# EAGLE design 007 (EAGLE 9.6.2)

## Sheet 1 of 2
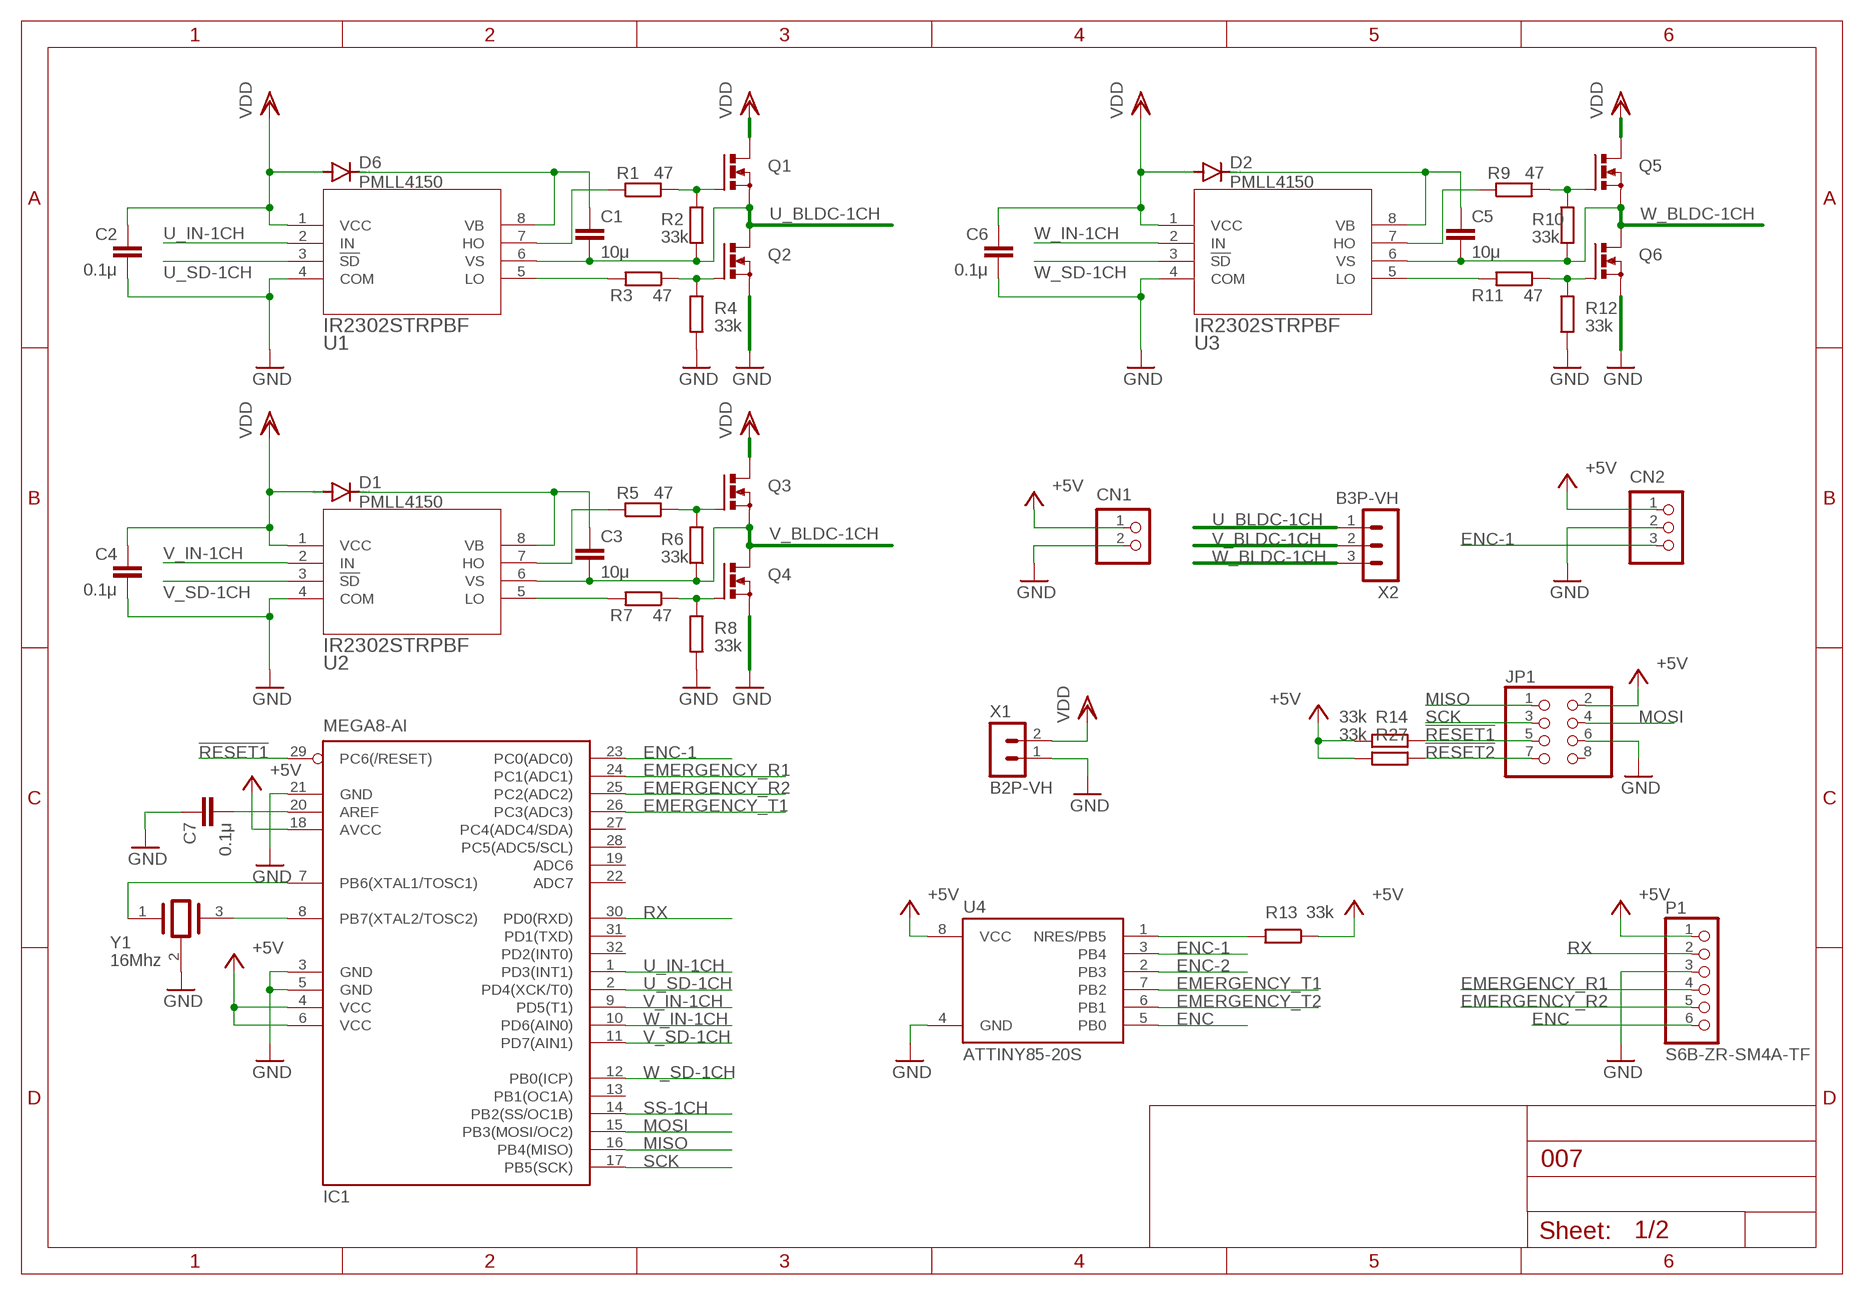
[diagram p0: schematic, sheet 1]

### Parts
C1  10μ  C-EUC1608  [C1608]
C2  0.1μ  C-EUC1608  [C1608]
C3  10μ  C-EUC1608  [C1608]
C4  0.1μ  C-EUC1608  [C1608]
C5  10μ  C-EUC1608  [C1608]
C6  0.1μ  C-EUC1608  [C1608]
C7  0.1μ  C-EUC1608  [C1608]
CN1  B2B-PH-K-S  [B2B-PH-K-S]
CN2  B3B-PH-K-S  [B3B-PH-K-S]
D1  PMLL4150  [SOD80C]
D2  PMLL4150  [SOD80C]
D6  PMLL4150  [SOD80C]
IC1  MEGA8-AI  [TQFP32-08]
JP1  PINHD-2X4  [2X04]
P1  S6B-ZR-SM4A-TF  [ZH-SM4-SIDE06]
Q1  N-MOSFET-SO8S  [SO-08]
Q2  N-MOSFET-SO8S  [SO-08]
Q3  N-MOSFET-SO8S  [SO-08]
Q4  N-MOSFET-SO8S  [SO-08]
Q5  N-MOSFET-SO8S  [SO-08]
Q6  N-MOSFET-SO8S  [SO-08]
R1  47  R-EU_R0603  [R0603]
R2  33k  R-EU_R0603  [R0603]
R3  47  R-EU_R0603  [R0603]
R4  33k  R-EU_R0603  [R0603]
R5  47  R-EU_R0603  [R0603]
R6  33k  R-EU_R0603  [R0603]
R7  47  R-EU_R0603  [R0603]
R8  33k  R-EU_R0603  [R0603]
R9  47  R-EU_R0603  [R0603]
R10  33k  R-EU_R0603  [R0603]
R11  47  R-EU_R0603  [R0603]
R12  33k  R-EU_R0603  [R0603]
R13  33k  R-EU_R0603  [R0603]
R14  33k  R-EU_R0603  [R0603]
R27  33k  R-EU_R0603  [R0603]
U1  IR2302STRPBF  [PG-DSO-8-910_INF]
U2  IR2302STRPBF  [PG-DSO-8-910_INF]
U3  IR2302STRPBF  [PG-DSO-8-910_INF]
U4  ATTINY85-20S  [SOIC8_EIAJ_208MIL]
X1  B2P-VH  [B2P-VH]
X2  B3P-VH  [B3P-VH]
Y1  16Mhz  MURATA_CSTNE16M0V53C000R0MURATA_CSTNE16M0V53C000R0_0_0  [MURATA_CSTNE16M0V53C000R0_0]

### Nets
!RESET1: IC1.29(PC6(/RESET)) JP1.5 R14.2
!RESET2: JP1.7 R27.2 ; also sheet 2
+5V: CN1.1 CN2.1 IC1.4(VCC) IC1.6(VCC) IC1.18(AVCC) JP1.2 P1.1 R13.1 R14.1 R27.1 U4.8(VCC) ; also sheet 2
EMERGENCY_R1: IC1.24(PC1(ADC1)) P1.4 ; also sheet 2
EMERGENCY_R2: IC1.25(PC2(ADC2)) P1.5 ; also sheet 2
EMERGENCY_T1: IC1.26(PC3(ADC3)) U4.7(PB2)
EMERGENCY_T2: U4.6(PB1) ; also sheet 2
ENC: P1.6 U4.5(PB0)
ENC-1: CN2.3 IC1.23(PC0(ADC0)) U4.3(PB4)
ENC-2: U4.2(PB3) ; also sheet 2
GND: C2.1 C4.1 C6.1 C7.2 CN1.2 CN2.2 IC1.3(GND) IC1.5(GND) IC1.21(GND) JP1.6 P1.3 Q2.1(S) Q2.2(S) Q2.3(S) Q4.1(S) Q4.2(S) Q4.3(S) Q6.1(S) Q6.2(S) Q6.3(S) R4.1 R8.1 R12.1 U1.4(COM) U2.4(COM) U3.4(COM) U4.4(GND) X1.1 Y1.2(GND) ; also sheet 2
MISO: IC1.16(PB4(MISO)) JP1.1 ; also sheet 2
MOSI: IC1.15(PB3(MOSI/OC2)) JP1.4 ; also sheet 2
N$1: C3.1 D1.C U2.8(VB)
N$2: C1.1 D6.C U1.8(VB)
N$3: R1.1 U1.7(HO)
N$4: R5.1 U2.7(HO)
N$5: Q1.4(G) R1.2 R2.2
N$6: Q2.4(G) R3.1 R4.2
N$7: R3.2 U1.5(LO)
N$8: Q3.4(G) R5.2 R6.2
N$9: Q4.4(G) R7.1 R8.2
N$10: R7.2 U2.5(LO)
N$11: C5.1 D2.C U3.8(VB)
N$12: R9.1 U3.7(HO)
N$13: Q5.4(G) R9.2 R10.2
N$14: Q6.4(G) R11.1 R12.2
N$15: R11.2 U3.5(LO)
N$16: R13.2 U4.1(NRES/PB5)
N$20: IC1.8(PB7(XTAL2/TOSC2)) Y1.3(OUTPUT)
N$21: IC1.7(PB6(XTAL1/TOSC1)) Y1.1(INPUT)
N$23: C7.1 IC1.20(AREF)
RX: IC1.30(PD0(RXD)) P1.2 ; also sheet 2
SCK: IC1.17(PB5(SCK)) JP1.3 ; also sheet 2
SS-1CH: IC1.14(PB2(SS/OC1B))
U_BLDC-1CH: C1.2 Q1.1(S) Q1.2(S) Q1.3(S) Q2.5(D) Q2.6(D) Q2.7(D) Q2.8(D) R2.1 U1.6(VS) X2.1
U_IN-1CH: IC1.1(PD3(INT1)) U1.2(IN)
U_SD-1CH: IC1.2(PD4(XCK/T0)) U1.3(!SD)
V_BLDC-1CH: C3.2 Q3.1(S) Q3.2(S) Q3.3(S) Q4.5(D) Q4.6(D) Q4.7(D) Q4.8(D) R6.1 U2.6(VS) X2.2
V_IN-1CH: IC1.9(PD5(T1)) U2.2(IN)
V_SD-1CH: IC1.11(PD7(AIN1)) U2.3(!SD)
VDD: C2.2 C4.2 C6.2 D1.A D2.A D6.A Q1.5(D) Q1.6(D) Q1.7(D) Q1.8(D) Q3.5(D) Q3.6(D) Q3.7(D) Q3.8(D) Q5.5(D) Q5.6(D) Q5.7(D) Q5.8(D) U1.1(VCC) U2.1(VCC) U3.1(VCC) X1.2 ; also sheet 2
W_BLDC-1CH: C5.2 Q5.1(S) Q5.2(S) Q5.3(S) Q6.5(D) Q6.6(D) Q6.7(D) Q6.8(D) R10.1 U3.6(VS) X2.3
W_IN-1CH: IC1.10(PD6(AIN0)) U3.2(IN)
W_SD-1CH: IC1.12(PB0(ICP)) U3.3(!SD)
Unconnected: IC1.13(PB1(OC1A)) IC1.19(ADC6) IC1.22(ADC7) IC1.27(PC4(ADC4/SDA)) IC1.28(PC5(ADC5/SCL)) IC1.31(PD1(TXD)) IC1.32(PD2(INT0)) JP1.8

## Sheet 2 of 2
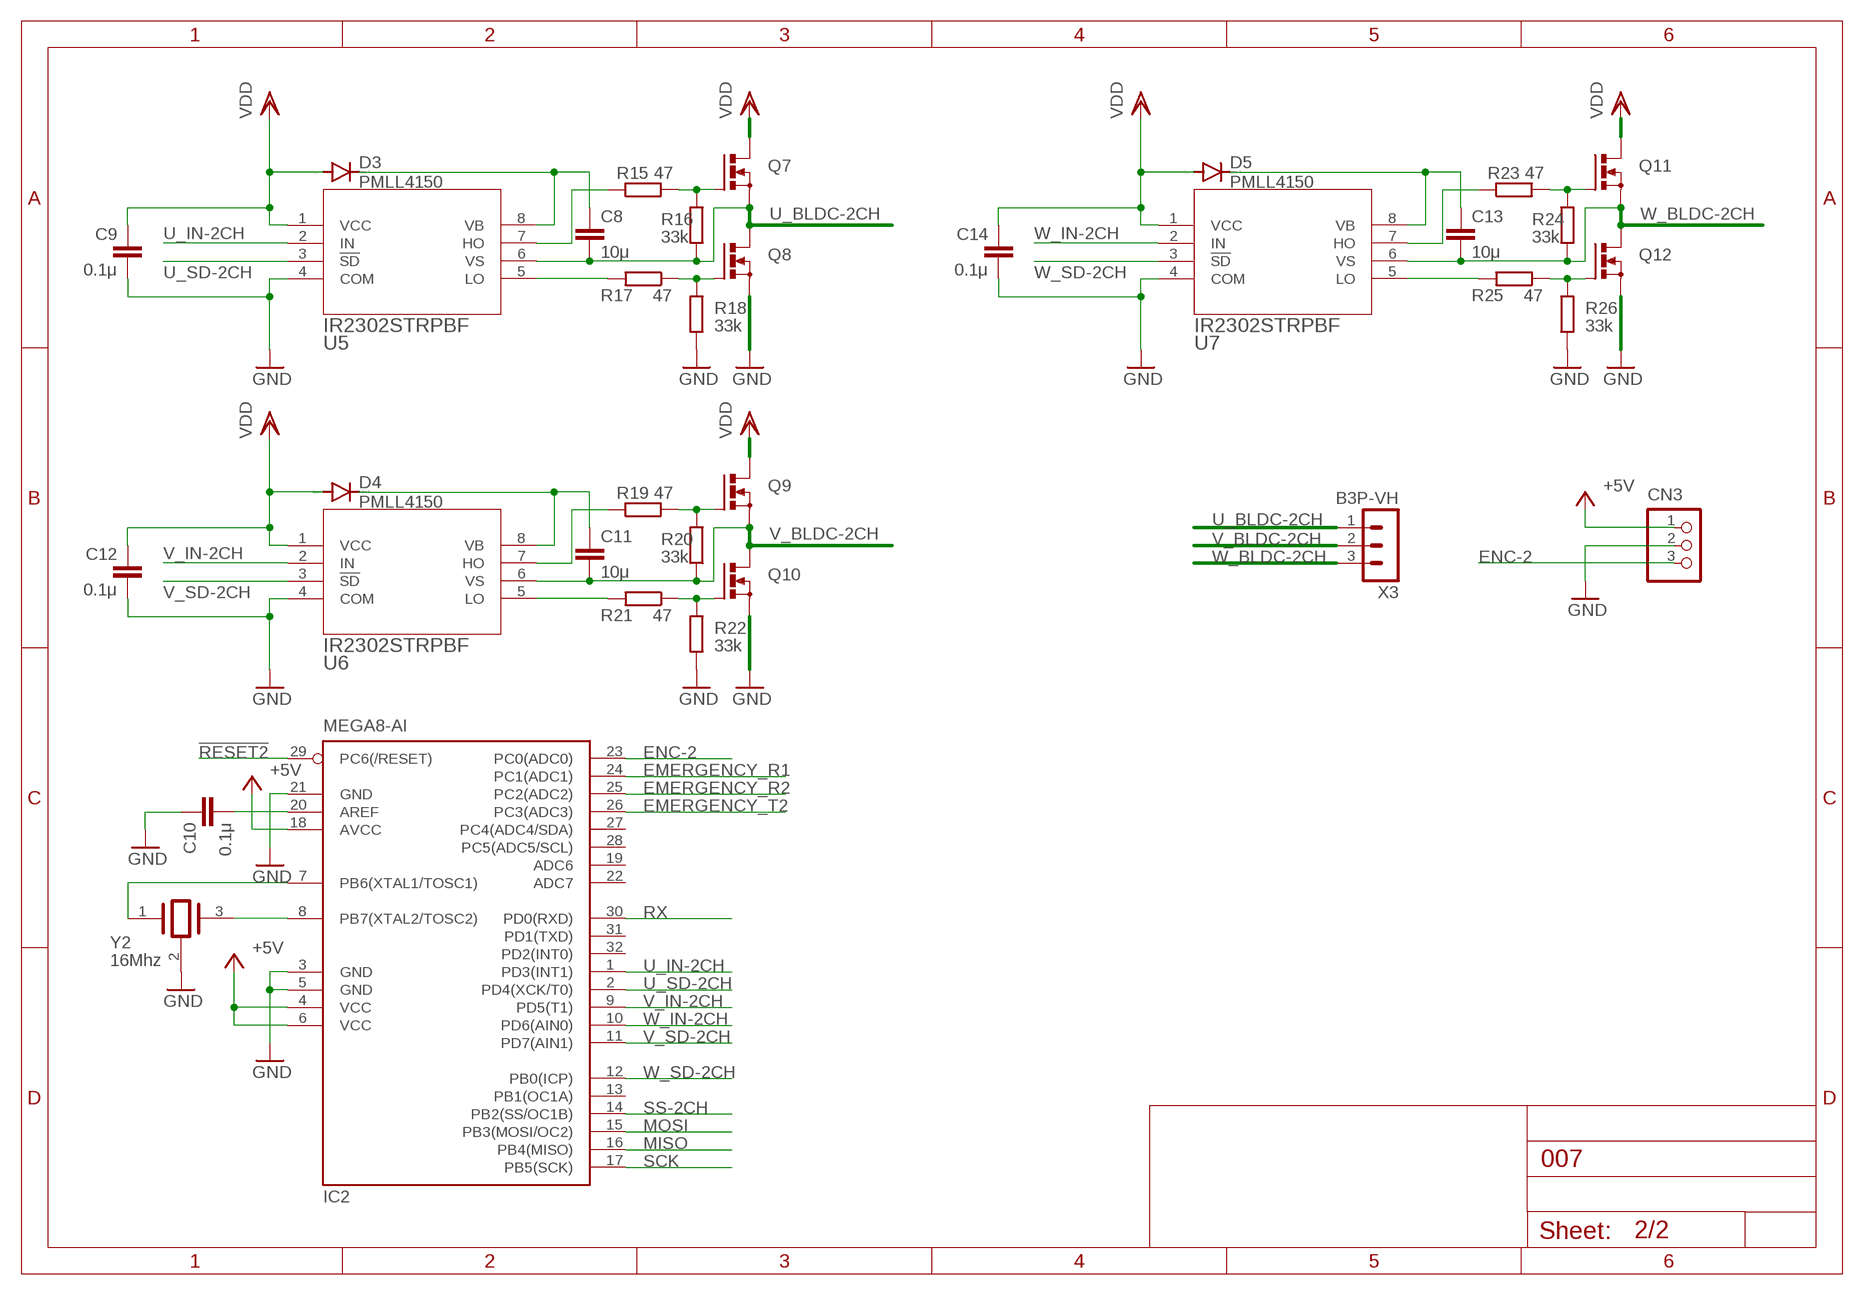
[diagram p1: schematic, sheet 2]

### Parts
C8  10μ  C-EUC1608  [C1608]
C9  0.1μ  C-EUC1608  [C1608]
C10  0.1μ  C-EUC1608  [C1608]
C11  10μ  C-EUC1608  [C1608]
C12  0.1μ  C-EUC1608  [C1608]
C13  10μ  C-EUC1608  [C1608]
C14  0.1μ  C-EUC1608  [C1608]
CN3  B3B-PH-K-S  [B3B-PH-K-S]
D3  PMLL4150  [SOD80C]
D4  PMLL4150  [SOD80C]
D5  PMLL4150  [SOD80C]
IC2  MEGA8-AI  [TQFP32-08]
Q7  N-MOSFET-SO8S  [SO-08]
Q8  N-MOSFET-SO8S  [SO-08]
Q9  N-MOSFET-SO8S  [SO-08]
Q10  N-MOSFET-SO8S  [SO-08]
Q11  N-MOSFET-SO8S  [SO-08]
Q12  N-MOSFET-SO8S  [SO-08]
R15  47  R-EU_R0603  [R0603]
R16  33k  R-EU_R0603  [R0603]
R17  47  R-EU_R0603  [R0603]
R18  33k  R-EU_R0603  [R0603]
R19  47  R-EU_R0603  [R0603]
R20  33k  R-EU_R0603  [R0603]
R21  47  R-EU_R0603  [R0603]
R22  33k  R-EU_R0603  [R0603]
R23  47  R-EU_R0603  [R0603]
R24  33k  R-EU_R0603  [R0603]
R25  47  R-EU_R0603  [R0603]
R26  33k  R-EU_R0603  [R0603]
U5  IR2302STRPBF  [PG-DSO-8-910_INF]
U6  IR2302STRPBF  [PG-DSO-8-910_INF]
U7  IR2302STRPBF  [PG-DSO-8-910_INF]
X3  B3P-VH  [B3P-VH]
Y2  16Mhz  MURATA_CSTNE16M0V53C000R0MURATA_CSTNE16M0V53C000R0_0_0  [MURATA_CSTNE16M0V53C000R0_0]

### Nets
!RESET2: IC2.29(PC6(/RESET)) ; also sheet 1
+5V: CN3.1 IC2.4(VCC) IC2.6(VCC) IC2.18(AVCC) ; also sheet 1
EMERGENCY_R1: IC2.24(PC1(ADC1)) ; also sheet 1
EMERGENCY_R2: IC2.25(PC2(ADC2)) ; also sheet 1
EMERGENCY_T2: IC2.26(PC3(ADC3)) ; also sheet 1
ENC-2: CN3.3 IC2.23(PC0(ADC0)) ; also sheet 1
GND: C9.1 C10.2 C12.1 C14.1 CN3.2 IC2.3(GND) IC2.5(GND) IC2.21(GND) Q8.1(S) Q8.2(S) Q8.3(S) Q10.1(S) Q10.2(S) Q10.3(S) Q12.1(S) Q12.2(S) Q12.3(S) R18.1 R22.1 R26.1 U5.4(COM) U6.4(COM) U7.4(COM) Y2.2(GND) ; also sheet 1
MISO: IC2.16(PB4(MISO)) ; also sheet 1
MOSI: IC2.15(PB3(MOSI/OC2)) ; also sheet 1
N$17: C8.1 D3.C U5.8(VB)
N$18: R15.1 U5.7(HO)
N$19: Q7.4(G) R15.2 R16.2
N$22: Q8.4(G) R17.1 R18.2
N$24: R17.2 U5.5(LO)
N$25: IC2.8(PB7(XTAL2/TOSC2)) Y2.3(OUTPUT)
N$26: IC2.7(PB6(XTAL1/TOSC1)) Y2.1(INPUT)
N$27: C10.1 IC2.20(AREF)
N$28: C11.1 D4.C U6.8(VB)
N$29: R19.1 U6.7(HO)
N$30: Q9.4(G) R19.2 R20.2
N$31: Q10.4(G) R21.1 R22.2
N$32: R21.2 U6.5(LO)
N$33: C13.1 D5.C U7.8(VB)
N$34: R23.1 U7.7(HO)
N$35: Q11.4(G) R23.2 R24.2
N$36: Q12.4(G) R25.1 R26.2
N$37: R25.2 U7.5(LO)
RX: IC2.30(PD0(RXD)) ; also sheet 1
SCK: IC2.17(PB5(SCK)) ; also sheet 1
SS-2CH: IC2.14(PB2(SS/OC1B))
U_BLDC-2CH: C8.2 Q7.1(S) Q7.2(S) Q7.3(S) Q8.5(D) Q8.6(D) Q8.7(D) Q8.8(D) R16.1 U5.6(VS) X3.1
U_IN-2CH: IC2.1(PD3(INT1)) U5.2(IN)
U_SD-2CH: IC2.2(PD4(XCK/T0)) U5.3(!SD)
V_BLDC-2CH: C11.2 Q9.1(S) Q9.2(S) Q9.3(S) Q10.5(D) Q10.6(D) Q10.7(D) Q10.8(D) R20.1 U6.6(VS) X3.2
V_IN-2CH: IC2.9(PD5(T1)) U6.2(IN)
V_SD-2CH: IC2.11(PD7(AIN1)) U6.3(!SD)
VDD: C9.2 C12.2 C14.2 D3.A D4.A D5.A Q7.5(D) Q7.6(D) Q7.7(D) Q7.8(D) Q9.5(D) Q9.6(D) Q9.7(D) Q9.8(D) Q11.5(D) Q11.6(D) Q11.7(D) Q11.8(D) U5.1(VCC) U6.1(VCC) U7.1(VCC) ; also sheet 1
W_BLDC-2CH: C13.2 Q11.1(S) Q11.2(S) Q11.3(S) Q12.5(D) Q12.6(D) Q12.7(D) Q12.8(D) R24.1 U7.6(VS) X3.3
W_IN-2CH: IC2.10(PD6(AIN0)) U7.2(IN)
W_SD-2CH: IC2.12(PB0(ICP)) U7.3(!SD)
Unconnected: IC2.13(PB1(OC1A)) IC2.19(ADC6) IC2.22(ADC7) IC2.27(PC4(ADC4/SDA)) IC2.28(PC5(ADC5/SCL)) IC2.31(PD1(TXD)) IC2.32(PD2(INT0))

## Library data of the parts
C1-C14 = rcl:C-EU: CAPACITOR, European symbol; SPICEPREFIX: C
CN1 = jst-ph:B2B-PH-*: Wire-to-Board 2.0mm pitch top mount connector Source: http://www.jst-mfg.com/product/pdf/jpn/PH.pdf http://www.jst-mfg.com/product/detail.php?series=199
CN2 CN3 = jst-ph:B3B-PH-*: Wire-to-Board 2.0mm pitch top mount connector Source: http://www.jst-mfg.com/product/pdf/jpn/PH.pdf http://www.jst-mfg.com/product/detail.php?series=199
D1-D6 = diode:PMLL4150: DIODE high speed
IC1 IC2 = atmel:MEGA8: MICROCONTROLLER 8 Kbytes FLASH, 1 kbytes SRAM, 512 bytes EEPROM, USART, 6-channel 10 bit ADC, 2-channel 8 bit ADC Pin compatible with Atmega48, ATMega88, ATMega168 Source: avr.lbr; MPN: ATMEGA8-16AU; OC_FARNELL: 9171371; OC_NEWARK: 73M8863
JP1 = pinhead:PINHD-2X4: PIN HEADER
P1 = zh:S6B-ZR-SM4A-TF
Q1-Q12 = transistor-power:N-MOSFET-SO8: N-Channel MOSFET Example: FDS7760A; N-Channel Logic Level PowerTrench® MOSFET FDS2572; N-Channel UltraFET® Trench MOSFET Source: www.fairchildsemi.com
R1-R27 = rcl:R-EU_: RESISTOR, European symbol; SPICEPREFIX: R
U1-U3 U5-U7 = IR2302:IR2302STRPBF; BUILT_BY: EMA_Cory; COPYRIGHT: Copyright (C) 2018 Accelerated Designs. All rights reserved; DATASHEET: https://www.infineon.com/dgdl/Infineon-IR2302-DataSheet-v01_00-EN.pdf?fileId=5546d462533600a4015355c988b216de; MANUFACTURER_PART_NUMBER: IR2302STRPBF; SOURCELIBRARY: Add_to_database_2021-04-22; VENDOR: Infineon
U4 = _hhn_attiny25_45_85:ATTINY85*: ATMEL ATtiny 85 Packages: P = PDIP 08 30mil S = SOIC 08 EIAJ 208mil Technologies Note: for complete ordering code (temp. range, finish, tape&reel etc.) see www.atmel.com • Supply Voltage: V = (1.8…5.5)V | [blank] = (2.7…5.5)V • Speed: 10 = 10 MHz | 20 = 20 MHz Author: Dipl.-Ing. FH Rainer Bayer HHN Hochschule Heilbronn (Heilbronn University), rainer.bayer@hs-heilbronn.de Ingenieurbüro ing-rb, mail@ing-rb.de
X1 = con-JST VH:B2P-VH: JST VH Series header 3.96mm pitch disconnectable crimp style connectors, vertical (side entry type), 2 pins
X2 X3 = con-JST VH:B3P-VH: JST VH Series header 3.96mm pitch disconnectable crimp style connectors, vertical (side entry type), 3 pins
Y1 Y2 = Murata - CSTNE16M0V53C000R0:MURATA_CSTNE16M0V53C000R0: 16MHz Ceramic Resonator Built in Capacitor 15pF ±0.15% 40 Ohms -40°C ~ 125°C Surface Mount; AUTOMOTIVE: Yes; AUTOMOTIVE_GRADE: Grade 1; CENTROID_NOT_SPECIFIED: No; DATASHEET: https://www.murata.com/ja-jp/products/productdetail.aspx?partno=CSTNE16M0V53C000R0; DEVICE_CLASS_L1: Passive Components; DEVICE_CLASS_L2: Crystals / Oscillators; DEVICE_CLASS_L3: Resonators; DIGIKEY_DESCRIPTION: CERAMIC RES 16.0000MHZ 15PF SMD; DIGIKEY_PART_NUMBER: 490-17949-1-ND; FOOTPRINT_VARIANT_NAME_0: Recommended_Land_Pattern; FREQUENCY: 16MHz; HEIGHT: 1mm; LEAD_FREE: Yes; LOAD_CAPACITANCE: 15pF; MF: Murata; MFG_PACKAGE_IDENT: 0; MFG_PACKAGE_IDENT_DATE: 0; MFG_PACKAGE_IDENT_REV: 0; MOUSER_DESCRIPTION: Ceramic Resonator 16MHz ±0.5% (Tol) ±0.15% (Stability) 15pF 40Ohm Automotive 3-Pin CSMD T/R; MOUSER_PART_NUMBER: 81-CSTNE16M0V53C000R; MPN: CSTNE16M0V53C000R0; PACKAGE: SMD; PREFIX: Y; ROHS: Yes; SERIES: CSTNE_V_C; STABILITY: 0.15%; TEMPERATURE_RANGE_HIGH: +125°C; TEMPERATURE_RANGE_LOW: -40°C; TOLERANCE: 0.5%; VERIFICATION_VERSION: 0.0.0.3

## Net classes
0 default: width 0.152 mm

## Board
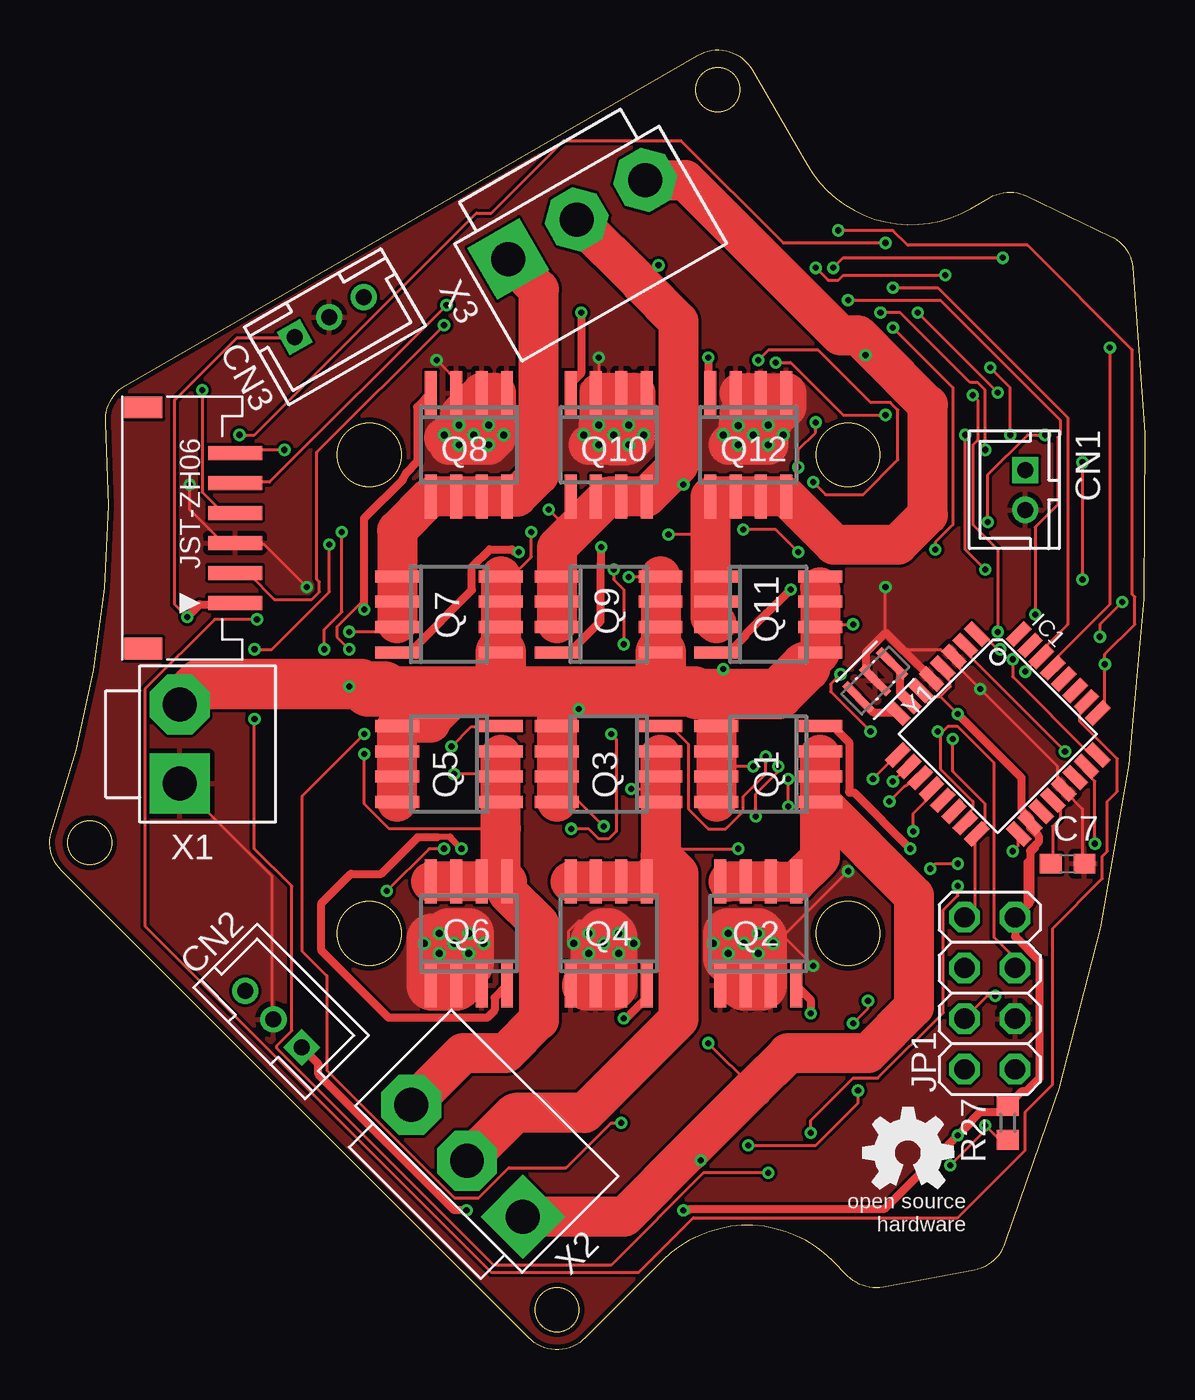
[diagram p2: board, top side]
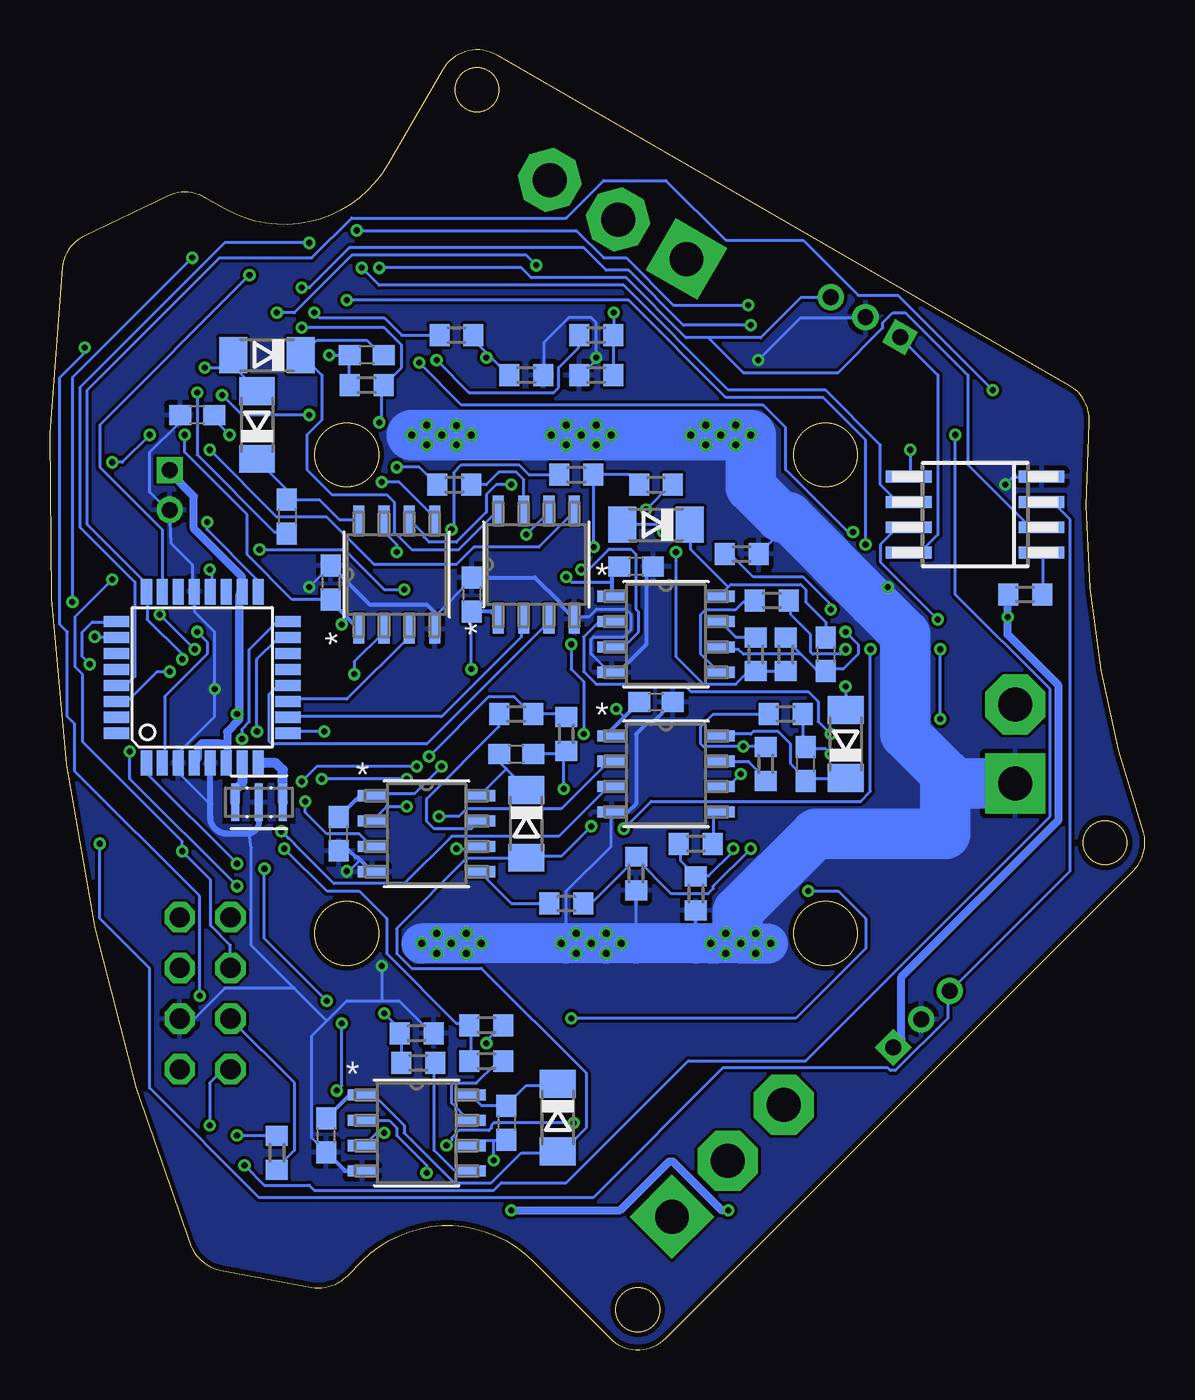
[diagram p3: board, bottom side, seen from below]

Size 54.89 x 65.17 mm. Coordinates in mm from the lower left corner, seen from the top.
Outline: 26.83,0.58 arc-90 24,0.58 0.58,24 arc-64 0.11,26.08 arc24 2.79,46.46 arc-64 3.79,48.34 32.47,64.9 arc-90 35.2,64.17 37.95,59.41 arc90 46.15,57.21 47.11,57.77 arc-56 48.98,57.84 53.15,55.84 arc-58 54.28,54.26 arc-28 47.82,5.22 arc-58 46.33,3.98 41.77,3.13 arc-56 39.99,3.69 39.21,4.47 arc90 30.72,4.47 26.83,0.58
Outline: circle at 40.01,20.87 radius 1.6
Outline: circle at 16.01,44.87 radius 1.6
Outline: circle at 16.01,20.87 radius 1.6
Outline: circle at 40.01,44.87 radius 1.6
Outline: circle at 2,25.42 radius 1.1
Outline: circle at 25.42,2 radius 1.1
Outline: circle at 33.47,63.17 radius 1.1
Copper layers (1*16): Top 0.035mm / dielectric 1.5mm / Bottom 0.035mm
Design rules "SeeedStudio_2layer_DRU_no_angle_20140221": minimum track width 6mil, minimum drill 12mil, track to track 6mil, track to pad 6mil, pad to pad 6mil, via to via 6mil, smd to smd 0mil, copper to edge 10mil, drill to drill 10mil, minimum pad ring 10mil, minimum via ring 6mil, stop-mask expansion 2mil, vias tented up to drill 100mil, thermal gap 10mil

### Footprints (pad centres in the part's own frame; a part is rotated, then mirrored left to right if it is on the bottom)
C1608 = smd 1.1 x 1: 1 -0.85,0; 2 0.85,0
B2B-PH-K-S = drill 0.8 square: 1 -1,0 | drill 0.8: 2 1,0
B3B-PH-K-S = drill 0.8 square: 1 -2,0 | drill 0.8: 2 0,0; 3 2,0
SOD80C = smd 1.4 x 1.8: A 1.7,0; C -1.7,0
TQFP32-08 = smd 1.27 x 0.559: 1 -4.293,2.8; 2 -4.293,2; 3 -4.293,1.2; 4 -4.293,0.4; 5 -4.293,-0.4; 6 -4.293,-1.2; 7 -4.293,-2; 8 -4.293,-2.8; 17 4.293,-2.8; 18 4.293,-2; 19 4.293,-1.2; 20 4.293,-0.4; 21 4.293,0.4; 22 4.293,1.2; 23 4.293,2; 24 4.293,2.8 | smd 0.559 x 1.27: 9 -2.8,-4.293; 10 -2,-4.293; 11 -1.2,-4.293; 12 -0.4,-4.293; 13 0.4,-4.293; 14 1.2,-4.293; 15 2,-4.293; 16 2.8,-4.293; 25 2.8,4.293; 26 2,4.293; 27 1.2,4.293; 28 0.4,4.293; 29 -0.4,4.293; 30 -1.2,4.293; 31 -2,4.293; 32 -2.8,4.293
2X04 = drill 1.016 octagon: 1 -3.81,-1.27; 2 -3.81,1.27; 3 -1.27,-1.27; 4 -1.27,1.27; 5 1.27,-1.27; 6 1.27,1.27; 7 3.81,-1.27; 8 3.81,1.27
ZH-SM4-SIDE06 = smd 0.7 x 2.7: 1 -10.35,-5.65; 2 -8.85,-5.65; 3 -7.35,-5.65; 4 -5.85,-5.65; 5 -4.35,-5.65; 6 -2.85,-5.65 | smd 1.1 x 1.9: P$1 -0.55,-1.05; P$2 -12.65,-1.05
SO-08 = smd 0.6 x 2.2: 1 -1.905,-2.6; 2 -0.635,-2.6; 3 0.635,-2.6; 4 1.905,-2.6; 5 1.905,2.6; 6 0.635,2.6; 7 -0.635,2.6; 8 -1.905,2.6
R0603 = smd 1 x 1.1: 1 -0.85,0; 2 0.85,0
PG-DSO-8-910_INF = smd 1.46 x 0.559: 1 -2.724,1.905; 2 -2.724,0.635; 3 -2.724,-0.635; 4 -2.724,-1.905; 5 2.724,-1.905; 6 2.724,-0.635; 7 2.724,0.635; 8 2.724,1.905
SOIC8_EIAJ_208MIL = smd 0.6 x 2.286: 1 -1.905,-3.33; 2 -0.635,-3.33; 3 0.635,-3.33; 4 1.905,-3.33; 5 1.905,3.33; 6 0.635,3.33; 7 -0.635,3.33; 8 -1.905,3.33
B2P-VH = drill 1.7 pad 3 square: 1 -1.98,0 | drill 1.7 pad 3 octagon: 2 1.98,0
B3P-VH = drill 1.7 pad 3 square: 1 -3.96,0 | drill 1.7 pad 3 octagon: 2 0,0; 3 3.96,0
MURATA_CSTNE16M0V53C000R0_0 = smd 0.4 x 1.9: 1 -1.2,0; 2 0,0; 3 1.2,0

### Placement (x,y rotation side)
C1  32.01,11.37 270 bottom
C2  40.41,25.87 90 bottom
C3  31.51,29.87 0 bottom
C4  24.51,32.47 180 bottom
C5  17.01,29.37 90 bottom
C6  41.03,10.75 90 bottom
C7  51.01,24.37 0 top
C8  16.01,34.87 270 bottom
C9  33.74,37.87 270 bottom
C10  47.51,46.87 180 bottom
C11  43.01,41.78 270 bottom
C12  40.81,38.47 270 bottom
C13  39.01,49.87 180 bottom
C14  25.51,39.27 180 bottom
CN1  48.89,43.11 270 top
CN2  11.21,16.57 135 top
CN3  14.01,51.77 30 top
D1  31.01,26.37 270 bottom
D2  15.01,30.37 90 bottom
D3  24.51,41.37 180 bottom
D4  44.51,46.37 90 bottom
D5  44.01,49.87 180 bottom
D6  29.43,11.64 270 bottom
IC1  47.51,30.87 315 top
IC2  47.25,33.71 90 bottom
JP1  47.11,17.87 270 top
P1  3.64,47.8 90 top
Q1  36.01,29.37 90 top
Q2  35.51,20.87 0 top
Q3  28.01,29.37 90 top
Q4  28.01,20.87 0 top
Q5  20.01,29.37 90 top
Q6  21.01,20.87 0 top
Q7  20.01,36.87 270 top
Q8  21.01,45.37 180 top
Q9  28.01,36.87 270 top
Q10  28.01,45.37 180 top
Q11  36.01,36.87 270 top
Q12  35.01,45.37 180 top
R1  33.01,14.47 180 bottom
R2  33.01,16.27 180 bottom
R3  36.43,14.38 0 bottom
R4  36.51,15.87 180 bottom
R5  31.51,31.87 0 bottom
R6  29.01,30.87 90 bottom
R7  29.01,22.37 180 bottom
R8  25.51,23.87 90 bottom
R9  19.01,29.37 90 bottom
R10  18.01,31.87 180 bottom
R11  22.51,25.37 0 bottom
R12  22.51,22.87 90 bottom
R13  6.01,37.87 0 bottom
R14  43.51,9.87 270 bottom
R15  19.51,34.87 270 bottom
R16  18.01,34.87 270 bottom
R17  18.71,37.57 180 bottom
R18  20.22,39.89 180 bottom
R19  28.51,43.87 0 bottom
R20  24.51,43.37 180 bottom
R21  27.51,50.87 180 bottom
R22  27.51,48.87 0 bottom
R23  34.62,43.37 180 bottom
R24  39.01,48.37 0 bottom
R25  34.51,50.87 180 bottom
R26  31.01,48.87 180 bottom
R27  48.01,11.37 270 top
U1  36.51,10.87 0 bottom
U2  36.01,25.87 0 bottom
U3  24.01,28.87 0 bottom
U4  8.51,41.87 90 bottom
U5  24.01,35.87 0 bottom
U6  37.51,38.87 90 bottom
U7  30.51,39.37 90 bottom
U$1  [OSHW_5MM]  43.01,9.87 0 top
X1  6.51,30.37 90 top
X2  20.91,9.47 135 top
X3  26.41,56.67 30 top
Y1  41.37,33.56 225 top
Y2  44.41,27.45 0 bottom

### Tracks (layer width: path | path; a pad name or v marks a point on that pad's centre or on a via)
!RESET1  (via drill 0.3)
  Top 0.152: v53.13,50.24 53.13,37.37 50.38,34.62 50.38,34.24 IC1.29 | JP1.5 46.98,17.74 v47.38,17.74
  Bottom 0.152: JP1.5 42.63,13.39 42.63,9.99 43.51,9.12 R14.2 | v53.13,50.24 53.13,49.99 54.38,48.74 54.38,36.37 54.01,35.99 54.01,31.74 53.63,31.37 53.63,28.99 47.38,22.74 v47.38,17.74
!RESET2  (via drill 0.3)
  Top 0.152: 47.01,11.12 47.51,10.62 48.01,10.62 R27.2 | v41.88,55.49 36.76,55.49 31.63,60.62 25.76,60.62 22.13,56.99 21.38,56.99 10.26,45.87 v9.51,45.87 | 47.01,11.12 v45.13,9.24 | 47.01,11.12 v46.88,11.24
  Bottom 0.152: v46.88,11.24 46.88,13.37 46.35,13.9 JP1.7 | v41.88,55.49 46.13,55.49 53.38,48.24 53.38,41.24 50.63,38.49 50.63,33.74 51.01,33.37 51.51,33.37 IC2.29 | v9.51,45.87 9.51,37.87 4.76,33.12 4.76,26.74 17.01,14.49 22.88,14.49 29.01,8.37 32.26,8.37 32.63,7.99 41.63,7.99 41.88,8.24 44.13,8.24 v45.13,9.24
+5V  (via drill 0.3)
  Top 0.152: 44.63,32.74 45.13,33.24 45.13,33.49 44.76,33.87 44.76,34.12 IC1.4 | 44.63,32.74 43.88,32.74 43.63,32.99 IC1.6 | 48.01,12.24 R27.1 | JP1.2 48.88,21.99 48.88,24.49 49.51,25.12 49.51,25.74 49.13,26.12 49.13,26.37 IC1.18 49.01,26.49 48.76,26.74 48.76,28.62 v45.51,31.87 44.63,32.74 | 9.26,37.37 P1.1 | v6.88,36.74 6.26,37.37 6.26,47.62 9.38,50.74 12.26,50.74 CN3.1 | 32.01,6.99 v31.76,6.99
  Top 0.4: 49.13,26.37 49.13,26.65 48.69,27.09 48.69,28.68 v45.51,31.87 | IC1.18 49.13,26.18 49.56,25.74 49.56,25.45 49.13,25.02 49.13,22.43 JP1.2 48.38,20.71 49.59,19.5 49.59,13.59 48.94,12.94 48.71,12.94 48.01,12.24 | R27.1 47.69,11.9 46.61,11.9 46.22,11.51 46.22,11.46 v45.51,10.74 41.81,7.04 32.08,7.04 32.02,6.99 32.01,6.99 | CN2.1 13.45,14.32 13.45,13.81 20.27,6.99 v20.88,6.99 | v6.88,36.74 7.51,37.37 9.26,37.37
  Bottom 0.152: 45.26,31.87 45.26,31.62 46.01,30.87 46.01,30.37 | 45.26,31.87 IC2.18 45.26,38.12 | 46.01,30.37 46.01,29.49 IC2.6 | 46.01,30.37 47.26,30.37 47.63,29.99 47.63,29.49 IC2.4 | 48.88,43.99 CN1.1 | v45.51,10.74 43.51,10.74 R14.1 | v45.51,31.87 45.26,31.87 | U4.8 11.76,39.99 11.26,39.99 10.38,40.87 10.38,48.87 12.26,50.74 CN3.1 | 6.88,37.87 R13.1
  Bottom 0.4: 48.88,43.99 47.66,42.77 47.66,41.17 45.25,38.75 IC2.18 45.41,37.83 45.41,31.56 46.01,30.97 46.01,29.49 | 46.01,30.37 46.39,30.37 46.42,30.4 47.27,30.4 47.48,30.19 47.48,29.64 47.63,29.49 | v31.76,6.99 26.3,6.99 23.85,9.44 23.66,9.44 21.21,6.99 v20.88,6.99 | CN2.1 12.21,15.56 12.21,18.68 4.33,26.56 4.33,33.29 6.88,35.85 v6.88,36.74 6.88,37.87
EMERGENCY_R1  (via drill 0.3)
  Top 0.152: v48.26,34.62 48.26,33.74 52.13,29.87 52.51,29.87 IC1.24 | v7.63,48.12 7.63,42.99 8.63,41.99 9.26,41.99 P1.4
  Bottom 0.152: v48.26,34.62 48.26,34.87 50.01,36.62 50.01,37.99 IC2.24 50.13,38.12 50.13,38.49 53.01,41.37 53.01,48.12 46.38,54.74 41.76,54.74 39.76,56.74 29.01,56.74 27.13,58.62 24.01,58.62 21.01,55.62 17.13,55.62 14.38,52.87 12.38,52.87 v7.63,48.12
EMERGENCY_R2  (via drill 0.3)
  Top 0.152: IC1.25 52.63,31.99 52.88,32.24 v52.88,34.37 52.88,34.87 54.38,36.37 54.38,37.74 54.26,37.87 54.26,50.12 49.01,55.37 43.01,55.37 42.26,56.12 v39.51,56.12 | v19.88,52.37 11.01,43.49 9.38,43.49 P1.5
  Bottom 0.152: v52.88,34.37 53.26,34.74 53.26,35.99 52.76,36.49 51.63,36.49 IC2.25 | v19.88,52.37 23.63,52.37 26.01,54.74 27.13,54.74 28.51,56.12 v39.51,56.12
EMERGENCY_T1  (via drill 0.3)
  Top 0.152: v10.38,36.62 8.26,36.62 4.76,33.12 4.76,21.24 22.13,3.87 29.51,3.87 32.26,6.62 45.51,6.62 48.88,9.99 48.88,11.92 50.26,13.29 50.26,21.12 52.76,23.62 52.76,24.74 53.01,24.99 53.01,27.49 53.51,27.99 53.51,29.62 51.63,31.49 51.63,31.87 51.88,32.12 51.88,32.37 IC1.26
  Bottom 0.152: v10.38,36.62 13.26,39.49 13.26,40.37 12.51,41.12 11.88,41.12 U4.7
EMERGENCY_T2  (via drill 0.3)
  Top 0.152: v52.63,35.74 52.63,36.37 v53.76,37.49 | v47.76,54.74 39.76,54.74 v39.26,54.24
  Bottom 0.152: v52.63,35.74 51.63,35.74 IC2.26 | v53.76,37.49 53.76,48.74 v47.76,54.74 | v39.26,54.24 38.38,53.37 26.13,53.37 20.88,48.12 16.01,48.12 13.26,45.37 13.26,43.37 12.51,42.62 11.88,42.62 U4.6
ENC  (via drill 0.3)
  Top 0.152: v11.76,45.12 9.51,45.12 9.38,44.99 P1.6
  Bottom 0.152: v11.76,45.12 11.76,43.87 U4.5
ENC-1  (via drill 0.3)
  Top 0.152: v52.38,25.37 52.38,28.49 52.01,28.87 52.01,29.24 IC1.23
  Bottom 0.152: v52.38,25.37 52.38,21.62 49.88,19.12 49.88,13.12 44.38,7.62 27.66,7.62 21.16,14.12 12.88,14.12 12.76,13.99 12.51,13.99 9.88,16.62 9.88,17.87 CN2.3 9.76,17.99 3.76,23.99 3.76,41.62 4.63,42.49 5.13,42.49 U4.3
ENC-2  (via drill 0.3)
  Top 0.152: v44.88,53.87 39.76,53.87 39.51,53.62 39.01,53.62 v38.38,54.24
  Bottom 0.152: v44.88,53.87 52.38,46.37 52.38,44.24 49.26,41.12 49.26,38.12 IC2.23 | v38.38,54.24 31.26,54.24 30.76,53.74 26.01,53.74 23.01,50.74 21.88,50.74 | 21.88,50.74 19.26,50.74 17.26,52.74 15.76,52.74 CN3.3 | 21.88,50.74 20.13,48.99 15.38,48.99 13.13,51.24 13.13,51.49 12.63,51.99 12.01,51.99 8.88,48.87 8.88,44.37 5.76,41.24 5.26,41.24 U4.2
GND  (via drill 0.3, 0.35)
  Top 0.152: 42.88,34.99 43.01,35.12 44.63,35.12 44.88,34.87 45.26,34.87 IC1.3 45.38,34.74 45.38,34.37 v46.63,33.12 50.51,29.24 50.51,28.37 50.76,28.12 IC1.21 50.88,27.99 51.76,27.12 51.76,24.37 C7.2 | v41.88,38.24 41.88,36.12 41.86,35.92 | v27.01,20.87 27.37,20.5 26.63,21.49 26.51,21.49 26.01,20.99 26.01,20.49 26.13,20.37 v26.26,20.37 | 28.51,19.99 27.37,19.99 | v40.01,23.99 36.88,20.87 35.69,20.68 | Q2.1 33.63,18.24 34.76,18.38 | v7.01,43.37 7.01,42.12 8.63,40.49 9.26,40.49 P1.3 9.38,40.37 10.76,40.37 v12.88,38.24 | Q6.1 19.13,18.24 19.76,18.87 | v27.51,49.74 27.51,48.87 Q10.3 | v19.38,49.62 20.63,48.37 Q8.3 | CN2.2 11.13,16.62 11.13,23.74 6.51,28.37 X1.1 | v38.26,19.24 36.88,20.62 35.69,20.62
  Top 0.2: v34.51,46.34 34.51,47.83 Q12.3 33.76,47.35 v33.76,45.87 | Q12.2 36.01,47.6 v36.01,46.37 | v35.26,45.87 35.01,45.87 | Q10.1 29.91,46.27 v29.01,45.37 v27.51,45.37 | Q10.1 29.35,47.41 29.35,46.21 | Q10.1 29.91,47.27 v29.01,46.37 | v27.51,46.37 27.51,46.83 Q10.2 | Q10.2 28.26,47.58 v28.26,45.87 | Q10.3 26.76,47.35 v26.76,45.87 | Q10.2 28.64,46.98 v29.76,45.87 | 35.01,47.97 35.01,46.74 v36.76,45.87 | v22.01,46.37 22.91,47.27 Q8.1 22.76,47.81 v22.76,45.87 | Q8.2 21.64,47.5 v20.51,46.37 | v21.26,45.87 21.26,47.08 Q8.3 | Q8.3 20.51,47.83 v20.51,45.37 | Q8.3 20.37,47 v22.01,45.37
  Top 0.305: v34.01,19.87 35.61,18.27 Q2.3 34.01,20.4 v34.01,20.87 | Q2.2 35.51,18.9 v35.51,20.87 | 34.78,18.27 v34.78,20.37 | Q2.2 34.87,19.23 v35.51,19.87 | Q2.2 34.87,18.98 v36.26,20.37 | v33.26,20.37 33.6,20.02 Q2.1 | 34.76,18.38 34.76,18.88 34.76,21.37 | Q4.3 28.64,19.73 v28.51,19.87 | Q4.1 26.26,18.42 v26.26,20.37 | v28.51,19.87 28.51,19.4 Q4.2 27.37,19.5 v27.01,19.87 27.51,20.37 v27.76,20.37 | v28.51,19.87 28.51,19.99 v28.51,20.87 | v29.26,20.37 28.51,20.37 28.01,20.87 | Q6.3 21.76,18.38 v21.76,20.37 | 19.63,19.49 v18.76,20.37 | v21.01,19.87 19.27,19.87 19.13,20 | v19.51,20.87 19.1,20.46 Q6.1 19.1,19.46 v19.51,19.87 | v20.26,20.37 20.26,18.38 Q6.2 20.86,18.27 19.63,19.49 | v21.01,20.87 19.63,19.49
  Top 0.406: Y1.2 40.91,34.02 40.91,34.97 41.86,35.92 41.96,35.92 42.88,34.99 44.19,33.68 IC1.5
  Top 2: 34.55,47.97 35.01,47.97 Q12.1 36.91,47.27 v36.01,46.37 v36.01,45.37 v34.51,45.37 v34.51,46.34 34.55,46.39 | Q12.2 34.55,46.88 34.55,46.39 | Q10.2 28.14,47.47 28.14,45.5 | Q10.2 27.55,47.97 27.55,46.39 27.51,46.34 v27.51,45.37 | 28.14,45.5 28.01,45.37 | 28.01,45.37 v27.51,45.37 | Q10.2 29.35,47.97 29.35,46.71 | 28.01,45.37 v29.01,45.37 29.01,45.42 29.32,45.73 | 28.14,45.5 29.35,46.71 | 29.35,46.21 29.35,46.71 | 34.55,46.39 34.55,45.91 34.01,45.37 | v27.51,45.37 27.01,45.37 | 19.76,45.71 19.88,45.71 20.55,46.39 20.55,46.88 Q8.2 22.35,47.97 22.35,45.71 v22.01,45.37 20.01,45.37
  Top 2.54: Q2.2 34.78,18.27 | Q2.2 35.69,18.27 35.69,20.62 35.69,20.68 v35.51,20.87 v34.01,20.87 34.01,19.63 34.76,18.88 | Q4.2 28.19,18.27 28.19,20.68 28.01,20.87 27.74,20.87 27.37,20.5 27.37,19.99 Q4.2 | Q4.2 26.93,18.27 | Q2.2 34.76,18.38 | 19.13,19.5 19.76,18.87 Q6.2 19.13,18.27 19.13,20 | 19.13,20 19.13,20.6 | 19.13,20 20,20.87 v21.01,20.87 21.01,19.37
  Bottom 0.152: C9.1 33.76,38.62 35.51,36.87 U6.4 | U7.4 28.51,36.74 27.88,36.74 27.51,37.12 26.01,37.12 25.76,36.87 25.76,36.12 26.13,35.74 27.63,35.74 27.76,35.62 27.76,34.87 26.76,33.87 U5.4 | v41.88,38.24 C12.1 | C10.2 48.38,46.87 48.38,46.49 49.88,44.99 49.88,42.99 49.01,42.12 CN1.2 48.81,40.42 47.76,39.37 47.76,38.12 IC2.21 47.63,37.99 47.63,36.99 46.63,35.99 v46.63,33.12 46.63,31.74 48.38,29.99 48.38,29.49 IC2.3 48.38,29.37 48.38,28.87 46.88,27.37 46.85,27.37 | 38.26,17.49 40.01,17.49 41.01,16.49 | 38.26,17.49 37.38,17.49 35.76,15.87 R4.1 | 41.01,16.49 41.76,15.74 41.76,10.62 41.13,9.99 C6.1 | 41.01,16.49 42.63,18.12 | 42.63,18.12 44.78,20.27 44.78,25.16 44.9,25.87 | 42.63,18.12 46.13,18.12 47.63,16.62 48.36,16.62 JP1.6 | v27.01,19.87 27.01,20.37 | 25.51,20.37 R8.1 | 22.51,20.74 R12.1 | 39.32,24.55 39.88,23.99 v40.01,23.99 | 29.01,20.37 29.01,22.99 26.76,25.24 26.76,26.87 U3.4 | v7.01,43.37 6.63,43.74 5.26,43.74 U4.4 | R18.1 19.26,39.99 18.63,40.62 18.24,41.74 | R26.1 30.13,48.87 30.13,50.49 28.88,51.74 27.76,51.74 27.51,51.49 v27.51,49.74 27.51,49.62 28.26,48.87 R22.1 | v19.38,49.62 17.26,51.74 14.01,51.74 CN3.2 | v20.26,20.37 20.41,21.17 | v12.88,38.24 13.63,37.49 | 22.51,20.74 22.51,20.37 | 22.51,20.74 v21.76,20.37 | v38.26,19.24 38.26,17.49
  Bottom 0.2: v36.01,45.37 35.76,45.37 v35.26,45.87 35.76,46.37 v36.01,46.37 36.63,45.74 v36.76,45.87 35.72,45.12 v34.51,46.34 34.23,46.34 v33.76,45.87 34.26,45.37 v34.51,45.37 | v29.76,45.87 29.51,45.87 v29.01,46.37 28.76,46.37 v28.26,45.87 | v28.26,45.87 28.51,45.87 v29.01,45.37 | v27.51,45.37 27.01,45.87 | 27.01,45.87 v27.51,46.37 27.76,46.37 v28.26,45.87 | 27.01,45.87 v26.76,45.87 | v20.51,45.37 19.3,45.37 v19.76,45.87 19.26,46.37 v20.51,46.37 21.01,45.87 v21.26,45.87 21.38,45.99 | v22.01,46.37 21.76,46.37 21.38,45.99 | 21.38,45.99 v22.01,45.37 22.51,45.87 v22.76,45.87 | C6.1 40.09,8.96 U1.4 | U2.4 39.32,24.55 39.47,24.7 39.56,24.7 39.88,25.02 C2.1 | C4.1 24.76,31.37 25.01,31.37 25.51,30.87 25.51,27.37 25.91,26.96 U3.4 | C14.1 25.01,38.92 25.01,35.37 26.41,33.96 U5.4 | U7.4 29.34,37.38 29.34,37.48 30.58,38.72 C9.1 | C12.1 38.86,37.37 36.01,37.37 35.6,36.96 U6.4
  Bottom 0.305: Y2.2 44.41,26.47 arc80 44.9,25.87 arc10 45.01,25.87 46.01,25.87 arc90 46.85,26.71 46.85,27.37 IC2.5
  Bottom 2: v20.26,20.37 20.51,20.62 | v20.26,20.37 v21.76,20.37 | 21.51,20.37 v21.76,20.37 | v21.76,20.37 22.51,20.37 25.51,20.37 27.01,20.37 29.01,20.37 v36.26,20.37 | v20.26,20.37 18.89,20.37
  Bottom 2.54: v36.76,45.87 27.01,45.87 | v26.76,45.87 v19.76,45.87 19.76,43.25 18.24,41.74 17.88,41.74 13.63,37.49 12.01,35.87 12.01,30.87 10.01,28.87 | 10.01,28.87 9.53,28.39 X1.1 | 10.01,28.87 10.01,25.87 16.51,25.87 20.41,21.97 20.41,21.17
  pour Top: 56.01,65.87 56.01,-1.13 -0.99,-1.13 -0.99,65.87
  pour Bottom: 56.01,65.87 56.01,-1.13 -0.99,-1.13 -0.99,65.87
MISO  (via drill 0.3)
  Top 0.152: JP1.1 46.35,21.83 46.38,21.87 46.38,25.74 IC1.16 46.51,25.87 46.88,26.24 46.88,27.37 45.26,28.99 v45.26,30.62
  Bottom 0.152: v45.26,30.62 45.26,31.12 44.88,31.49 44.88,35.12 43.51,36.49 43.01,36.49 IC2.16
MOSI  (via drill 0.3)
  Top 0.152: 44.63,30.87 44.63,29.12 46.26,27.49 46.26,27.12 46.01,26.87 46.01,26.49 IC1.15 | 44.63,30.87 45.01,31.24 45.51,31.24 47.33,29.42 47.33,20.67 48.38,19.62 JP1.4 | 44.63,30.87 v44.51,30.99
  Bottom 0.152: v44.51,30.99 44.51,34.62 43.51,35.62 43.01,35.62 IC2.15
N$1
  Bottom 0.152: 32.01,29.12 31.01,28.12 D1.C | 32.01,29.12 32.26,29.37 32.26,29.87 C3.1 | 32.01,29.12 33.26,27.87 U2.8
N$2
  Bottom 0.152: 32.01,12.24 33.26,12.24 33.76,12.74 U1.8 | 32.01,12.24 31.01,13.24 29.51,13.24 D6.C | 32.01,12.24 C1.1
N$3
  Bottom 0.152: R1.1 32.26,14.37 32.51,14.37 33.51,13.37 34.63,13.37 34.76,13.24 34.76,12.37 33.88,11.49 U1.7
N$4
  Bottom 0.152: R5.1 32.38,31.87 32.38,31.24 36.01,27.62 36.01,26.49 35.63,26.12 33.76,26.12 33.38,26.49 U2.7
N$5  (via drill 0.3)
  Top 0.152: 40.06,27.94 40.07,27.93
  Top 0.4: Q1.4 38.71,31.17 39.33,31.17 40.06,30.45 40.06,27.94 | 40.07,27.93 40.32,27.93 v43.13,25.12
  Bottom 0.152: R1.2 33.76,14.49 33.76,16.24 R2.2 33.88,16.37 34.51,16.37 38.01,19.87 38.01,21.62 39.38,22.99 41.01,22.99 v43.13,25.12
N$6  (via drill 0.3)
  Top 0.4: Q2.4 38.13,17.55 v38.13,16.87
  Bottom 0.152: R3.1 37.26,14.49 37.26,15.87 R4.2 37.38,15.87 37.38,16.12 v38.13,16.87
N$7
  Bottom 0.152: R3.2 35.63,14.37 35.63,9.99 34.63,8.99 33.88,8.99 U1.5
N$8  (via drill 0.3)
  Top 0.152: v35.88,29.74 35.88,28.87 34.76,27.74 34.76,26.99 33.88,26.12 33.01,26.12 32.01,27.12 32.01,30.37 31.13,31.24 30.63,31.24 Q3.4
  Bottom 0.152: R6.2 29.01,31.74 29.13,31.87 R5.2 30.76,31.87 31.63,32.74 32.88,32.74 v35.88,29.74
N$9  (via drill 0.3)
  Top 0.152: 29.88,17.74 29.88,18.24 Q4.4 | v16.88,22.99 19.01,25.12 v19.76,25.12
  Top 0.4: v28.76,16.62 28.78,16.64 28.92,16.64 29.88,17.61 29.88,17.74
  Bottom 0.152: R7.1 27.76,22.37 25.51,24.62 | v28.76,16.62 17.51,16.62 14.01,20.12 14.01,21.62 15.38,22.99 v16.88,22.99 | v19.76,25.12 21.63,23.24 21.63,23.12 21.88,22.87 23.76,22.87 25.51,24.62 | 25.51,24.62 R8.2
N$10
  Bottom 0.152: R7.2 31.76,22.37 33.26,23.87 U2.5
N$11
  Bottom 0.152: 17.01,28.62 15.01,28.62 D2.C | 17.01,28.62 17.76,29.37 17.76,30.37 18.38,30.99 19.63,30.99 19.76,30.87 21.26,30.87 U3.8 | 17.01,28.62 C5.1
N$12
  Bottom 0.152: R9.1 19.01,28.62 19.88,29.49 21.26,29.49 U3.7
N$13  (via drill 0.3)
  Top 0.152: v20.13,30.24 21.13,31.24 22.51,31.24 Q5.4
  Bottom 0.152: R10.2 21.63,31.87 22.26,31.24 22.26,30.37 22.13,30.24 v20.13,30.24 19.01,30.24 R9.2
N$14  (via drill 0.3)
  Top 0.152: 20.01,25.74 19.01,25.74
  Top 0.254: v20.63,25.12 20.58,25.12 20,25.7 19.05,25.7 19.01,25.74
  Top 0.305: 19.4,25.69 19.46,25.69 19.5,25.73 20.01,25.73 20.08,25.73 20.11,25.69 20.11,25.63 v20.63,25.12
  Top 0.4: Q6.4 22.29,17.65 22.29,17.02 21.92,16.64 16.98,16.64 13.61,20.02 13.61,22.38 15.09,23.86 16.6,23.86 18.43,25.69 19.4,25.69
  Bottom 0.152: 22.51,23.74 23.26,24.49 23.26,25.37 R11.1 | 22.51,23.74 21.88,23.74 20.63,24.99 v20.63,25.12 | 22.51,23.74 R12.2
N$15
  Bottom 0.152: R11.2 21.63,25.37 21.63,26.62 21.38,26.87 U3.5
N$16
  Bottom 0.152: R13.2 5.13,37.87 5.13,39.87 U4.1
N$17
  Bottom 0.152: C8.1 16.01,36.49 17.01,37.49 17.01,38.12 17.26,38.37 20.76,38.37 20.88,38.24 | 20.88,38.24 21.26,37.87 U5.8 | 20.88,38.24 22.76,40.12 22.76,41.37 D3.C
N$18
  Bottom 0.152: R15.1 19.51,35.74 20.51,35.74 21.26,36.49 U5.7
N$19  (via drill 0.3)
  Top 0.4: Q7.4 17.51,35.06 18.13,35.06 21.15,38.08 21.15,39.23 22.05,40.12 23.17,40.12 23.3,39.99 v23.51,39.99
  Bottom 0.152: 19.51,33.99 18.01,33.99 R16.2 | 19.51,33.99 19.88,33.99 20.51,33.37 22.13,33.37 23.51,34.74 v23.51,39.99 | 19.51,33.99 R15.2
N$20
  Top 0.406: IC1.8 41.3,31.92 Y1.3
N$21
  Top 0.406: IC1.7 42.61,32.93 42.61,34 Y1.1
N$22  (via drill 0.3)
  Top 0.152: 15.76,37.62 15.76,41.87 18.38,44.49 | 15.76,37.62 v15.76,37.12 | v15.01,35.12 14.38,35.74 14.38,36.24 15.76,37.62
  Top 0.4: v15.76,37.12 15.76,41.69 17.7,43.64 17.7,43.68 17.87,43.98 18.38,44.49 18.4,44.51 18.4,47.26 Q8.4
  Bottom 0.152: v15.76,37.12 15.76,37.37 17.13,38.74 19.63,38.74 20.76,39.87 21.01,39.87 R18.2 | v15.01,35.12 15.26,34.87 16.63,34.87 16.76,34.99 16.76,35.87 17.76,36.87 17.76,37.49 R17.1
N$23
  Top 0.152: C7.1 50.26,24.37 50.26,26.24 50.63,26.62 50.63,27.24 50.38,27.49 IC1.20
N$24
  Bottom 0.152: R17.2 19.63,37.49 20.13,37.49 20.51,37.12 22.01,37.12 22.26,36.87 22.26,34.87 21.38,33.99 U5.5
N$25
  Bottom 0.508: Y2.3 43.21,29.07 43.55,29.41 IC2.8
N$26
  Bottom 0.508: 45.25,29 IC2.7 45.25,28.41 45.61,28.05 Y2.1
N$27  (via drill 0.3)
  Top 0.152: v45.88,45.87 45.88,40.12 v46.88,39.12
  Bottom 0.152: v45.88,45.87 46.63,46.62 46.63,46.87 C10.1 | v46.88,39.12 46.76,38.99 46.76,38.12 IC2.20
N$28
  Bottom 0.152: D4.C 44.51,44.62 43.01,43.12 C11.1 41.38,42.62 40.38,41.62 39.51,41.62 U6.8
N$29  (via drill 0.3)
  Top 0.152: v34.76,41.12 36.38,41.12 v37.51,39.99
  Bottom 0.152: R19.1 30.88,43.87 31.38,44.37 34.26,44.37 34.63,43.99 34.63,41.24 v34.76,41.12 | v37.51,39.99 37.51,40.37 38.13,40.99 38.13,41.49 U6.7
N$30  (via drill 0.3)
  Top 0.4: Q9.4 25.51,35.06 26.13,35.06 27.6,36.52 27.6,39.39 27.63,39.42 v27.63,40.24
  Bottom 0.152: 27.63,43.87 25.88,43.87 25.38,43.37 R20.2 | v27.63,40.24 27.63,43.87 | 27.63,43.87 R19.2
N$31  (via drill 0.3)
  Top 0.4: Q10.4 26.2,48.07 26.2,48.53 26.63,48.96 v26.63,51.99
  Bottom 0.152: 26.63,50.87 26.63,48.87 R22.2 | v26.63,51.99 26.63,50.87 | 26.63,50.87 R21.1
N$32  (via drill 0.3)
  Top 0.152: v35.51,49.62 36.01,50.12 38.51,50.12 41.13,47.49 42.13,47.49 42.51,47.12 42.51,44.62 40.76,42.87 38.88,42.87 v38.26,43.49
  Bottom 0.152: v35.51,49.62 33.88,47.99 29.63,47.99 29.38,48.24 29.38,49.24 28.38,50.24 28.38,50.87 R21.2 | v38.26,43.49 37.38,43.49 35.51,41.62 U6.5
N$33
  Bottom 0.152: 42.26,49.87 41.51,50.62 39.01,50.62 38.26,49.87 C13.1 | 42.26,49.87 41.26,48.87 41.26,46.62 42.01,45.87 42.01,44.12 40.76,42.87 38.01,42.87 37.63,42.49 37.63,40.99 36.76,40.12 34.38,40.12 32.51,41.99 U7.8 | 42.26,49.87 D5.C
N$34
  Bottom 0.152: R23.1 33.01,43.37 32.38,43.99 31.51,43.99 31.13,43.62 31.13,42.12 U7.7
N$35  (via drill 0.3)
  Top 0.152: v38.38,46.49 38.38,45.99 37.51,45.12 v37.51,44.24 | v44.38,40.12 44.38,40.49 45.26,41.37 45.26,48.24 v42.26,51.24
  Top 0.4: Q11.4 33.51,35.06 34.13,35.06 34.86,35.78 34.86,35.84 v37.13,38.12
  Bottom 0.152: v38.38,46.49 38.26,46.62 38.26,48.37 R24.2 38.13,48.37 37.26,49.24 37.26,50.37 38.13,51.24 v42.26,51.24 | v37.51,44.24 36.38,44.24 35.51,43.37 R23.2 | v37.13,38.12 38.13,38.12 40.13,40.12 v44.38,40.12
N$36  (via drill 0.3)
  Top 0.152: 33.01,48.87 33.01,47.99 Q12.4
  Top 0.4: v33.01,49.74 33.01,48.87
  Bottom 0.152: 32.88,49.87 31.88,48.87 R26.2 | 32.88,49.87 33.63,50.62 33.63,50.87 R25.1 | 32.88,49.87 v33.01,49.74
N$37  (via drill 0.3)
  Top 0.152: v41.63,51.99 42.63,51.99 46.13,48.49 46.51,48.49 46.88,48.12 v46.88,45.12
  Bottom 0.152: R25.2 37.26,50.87 38.13,51.74 41.38,51.74 v41.63,51.99 | v46.88,45.12 43.51,41.74 41.01,41.74 38.63,39.37 34.51,39.37 33.63,40.24 30.38,40.24 28.63,41.99 U7.5
RX  (via drill 0.3)
  Top 0.152: v48.88,33.99 49.63,34.74 IC1.30 49.76,34.87 49.76,35.12 51.01,36.37 51.01,46.74 44.51,53.24 v42.26,53.24 | v19.76,51.37 13.38,44.99 13.38,38.62 13.51,38.49 13.51,37.99 13.13,37.62 11.26,37.62 10.01,38.87 9.38,38.87 P1.2
  Bottom 0.152: v48.88,33.99 49.51,33.99 50.88,32.62 51.51,32.62 IC2.30 | v42.26,53.24 41.88,53.24 39.88,55.24 28.13,55.24 27.01,54.12 25.88,54.12 23.13,51.37 v19.76,51.37
SCK  (via drill 0.3)
  Top 0.152: v48.26,24.99 48.51,25.24 48.51,25.74 48.56,25.8 IC1.17 | v51.76,44.49 v51.76,38.62 | v49.88,45.87 49.01,45.87 47.01,43.87 v47.01,41.49
  Bottom 0.152: v51.76,38.62 53.63,36.74 53.63,34.24 53.26,33.87 53.26,30.49 48.26,25.49 v48.26,24.99 46.83,23.56 46.83,21.27 45.84,20.27 JP1.3 | v51.76,44.49 51.26,44.49 v49.88,45.87 | v47.01,41.49 47.01,41.12 44.51,38.62 44.51,38.12 IC2.17
U_BLDC-1CH  (via drill 0.3)
  Top 0.152: 35.26,13.12 v33.01,15.37 | v32.63,9.49 32.13,9.99 | Q1.3 38.63,29.99 38.61,29.82
  Top 0.406: Q2.8 34.01,23.47 Q2.7 36.51,23.47 | Q2.6 37.01,23.47 | Q1.3 38.61,29.87 | 38.61,28.87 Q1.2 Q1.1
  Top 2: 38.61,28.87 38.61,24.66 Q2.5 37.01,23.47 36.51,23.47 34.01,23.47 | Q1.1 43.31,22.76 43.31,17.17 41.01,14.87 37.01,14.87 35.26,13.12 32.13,9.99 28.81,6.67 X2.1 | Q1.2 38.61,29.82
  Bottom 0.152: 32.63,10.49 33.51,10.49 33.76,10.24 U1.6 | 32.63,10.49 32.01,10.49 C1.2 | v33.01,15.37 33.01,15.49 32.26,16.24 R2.1 | v32.63,9.49 32.63,10.49
U_BLDC-2CH  (via drill 0.3)
  Top 0.152: Q8.7 21.63,42.74 21.63,42.77 | 17.41,38.74 17.38,38.74 Q7.1 | Q8.6 20.38,42.74 20.38,42.77 | Q7.2 17.38,37.49 Q7.2 | 17.41,36.41 17.38,36.12 Q7.3 16.51,35.99 v15.01,35.99
  Top 2: 17.41,36.41 Q7.2 17.41,38.74 Q7.1 17.41,41.07 Q8.5 Q8.6 20.38,42.77 21.63,42.77 Q8.7 Q8.8 23.41,42.77 24.51,43.87 24.51,53.16 X3.1
  Bottom 0.152: 17.26,34.87 16.51,34.12 16.01,34.12 | 17.26,34.87 18.01,35.62 R16.1 | 17.26,34.87 20.13,34.87 20.38,35.12 21.26,35.12 U5.6 | 16.01,34.12 15.13,34.12 14.38,34.87 14.38,35.37 v15.01,35.99 | 16.01,34.12 C8.2
U_IN-1CH  (via drill 0.3)
  Top 0.152: v47.63,35.12 47.51,35.12 46.76,35.87 46.51,35.87 IC1.1 | v49.38,36.87 49.38,41.24 50.51,42.37 50.51,45.74 50.63,45.87 50.63,46.62 44.63,52.62 v40.01,52.62 | v14.01,40.37 14.01,37.99 11.13,35.12 v10.26,35.12 | v10.26,31.62 10.26,25.12 12.13,23.24 12.13,15.99 11.38,15.24 11.38,15.12 22.26,4.24 28.13,4.24 32.76,8.87 v36.01,8.87
  Bottom 0.152: v49.38,36.87 v47.63,35.12 | v40.01,52.62 25.88,52.62 21.01,47.74 16.13,47.74 14.01,45.62 v14.01,40.37 | v10.26,31.62 v10.26,35.12 | v36.01,8.87 36.01,9.24 37.51,10.74 37.51,11.12 37.88,11.49 39.13,11.49 U1.2
U_IN-2CH  (via drill 0.3)
  Top 0.152: v45.51,24.37 44.38,24.37 v44.13,24.12 | v41.01,17.49 41.01,17.12 v40.26,16.37 | v40.51,12.99 40.51,12.37 38.38,10.24 v35.01,10.24 | v28.63,11.37 28.13,11.37 25.88,9.12 23.01,9.12 21.51,7.62 20.26,7.62 13.88,13.99 13.88,18.74 12.63,19.99 12.63,27.74 v15.76,30.87
  Bottom 0.152: v45.51,24.37 50.01,28.87 50.01,29.37 IC2.1 | v44.13,24.12 44.13,20.62 v41.01,17.49 | v40.26,16.37 40.26,13.24 v40.51,12.99 | v35.01,10.24 34.76,10.49 34.76,10.62 34.38,10.99 32.88,10.99 32.76,11.12 32.76,11.24 32.63,11.37 v28.63,11.37 | v15.76,30.87 16.38,31.49 16.38,32.49 16.88,32.99 22.76,32.99 23.13,33.37 27.51,33.37 28.13,33.99 28.13,35.74 27.38,36.49 26.76,36.49 U5.2
U_SD-1CH  (via drill 0.3)
  Top 0.152: v50.88,29.99 46.01,34.87 46.01,35.24 IC1.2 | v45.51,23.24 45.51,22.77 44.78,22.04 44.78,16.89 41.51,13.62 40.26,13.62 38.13,11.49 v38.13,10.87
  Bottom 0.152: v50.88,29.99 50.88,28.62 v45.51,23.24 | v38.13,10.87 38.51,10.87 39.13,10.24 U1.3
U_SD-2CH  (via drill 0.3)
  Top 0.152: v47.51,35.99 47.51,40.12 46.26,41.37 46.26,45.37 46.51,45.62 46.51,47.62 v46.26,47.87 | v41.88,46.87 39.76,46.87 37.13,49.49 v36.38,49.49 | v14.63,40.99 14.63,36.99 13.76,36.12 v13.76,35.12 | v26.13,26.12 27.01,26.12 27.51,25.62 28.01,25.62 28.38,25.99 28.38,30.62 v28.13,30.87 | v28.76,35.37 28.76,38.12 28.26,38.62 v28.26,39.12
  Bottom 0.152: v47.51,35.99 47.01,35.49 47.01,34.87 49.13,32.74 49.13,29.49 IC2.2 | v46.26,47.87 45.26,46.87 v41.88,46.87 | v36.38,49.49 34.26,47.37 19.13,47.37 18.01,46.24 18.01,44.12 14.88,40.99 v14.63,40.99 | v13.76,35.12 13.76,27.99 14.26,27.49 24.76,27.49 v26.13,26.12 | v28.13,30.87 28.13,33.49 28.76,34.12 v28.76,35.37 | v28.26,39.12 27.88,39.12 26.88,40.12 25.76,40.12 25.51,39.87 25.51,37.12 25.38,36.99 25.38,35.99 26.13,35.24 26.63,35.24 U5.3
V_BLDC-1CH  (via drill 0.3)
  Top 0.152: Q4.6 28.63,23.49 28.63,23.47 | 27.38,23.47 27.38,23.49 Q4.7 | v34.51,25.12 31.63,25.12 30.94,24.43 | v29.13,28.12 30.61,28.12 | Q3.3 30.63,29.99 30.61,29.82 | Q3.2 30.63,28.62 30.61,28.62 | Q4.5 30.51,23.49 31.19,24.18
  Top 2: 30.61,24.16 Q4.5 Q4.6 28.63,23.47 27.38,23.47 Q4.7 Q4.8 | 30.61,29.82 Q3.2 30.61,28.62 30.61,28.12 Q3.1 30.61,24.77 30.94,24.43 31.19,24.18 31.51,23.87 31.51,16.57 26.81,11.87 23.31,11.87 X2.2
  Bottom 0.152: 29.13,29.87 C3.2 | 29.13,29.87 29.01,29.99 R6.1 29.13,29.87 | v34.51,25.12 33.38,25.12 U2.6 | v29.13,28.12 29.13,29.87
V_BLDC-2CH  (via drill 0.3)
  Top 0.152: v43.51,51.99 v47.51,47.99 | v30.51,54.37 29.61,53.47 | v25.01,42.12 26.15,40.97 | v31.76,43.37 31.13,43.99 | Q10.7 28.63,42.74 27.95,42.77 | Q10.6 27.38,42.74 27.65,42.47 | Q10.5 26.13,42.74 27.03,41.84 | Q9.1 25.38,38.74 25.41,38.74 | Q9.2 25.38,37.49 Q9.2 | Q9.3 25.38,36.12 25.41,36.41
  Top 2: 25.41,36.41 Q9.2 25.41,38.74 Q9.1 25.41,40.22 26.15,40.97 27.03,41.84 27.65,42.47 27.95,42.77 Q10.7 Q10.8 31.13,43.99 31.51,44.36 31.51,51.57 29.61,53.47 X3.2
  Bottom 0.152: v47.51,47.99 47.51,44.87 43.63,40.99 43.01,40.99 C11.2 | v43.51,51.99 42.63,51.99 39.76,54.87 31.01,54.87 v30.51,54.37 | v25.01,42.12 23.76,43.37 R20.1 | v31.76,43.37 32.51,43.37 33.01,42.87 33.01,41.99 34.51,40.49 35.88,40.49 36.13,40.74 36.13,40.87 36.76,41.49 U6.6
V_IN-1CH  (via drill 0.3)
  Top 0.152: v41.26,28.62 42.38,29.74 IC1.9 | v37.01,27.24 v37.01,28.62
  Bottom 0.152: v37.01,28.62 v41.26,28.62 | v37.01,27.24 38.01,27.24 38.63,26.62 U2.2
V_IN-2CH  (via drill 0.3)
  Top 0.152: v41.13,30.99 39.13,32.99 39.13,33.37 v39.63,33.87
  Bottom 0.152: v41.13,30.99 42.88,30.99 IC2.9 | v39.63,33.87 39.63,34.49 38.26,35.87 38.26,36.12 U6.2
V_SD-1CH  (via drill 0.3)
  Top 0.152: v42.08,27.49 42.85,28.26 IC1.11
  Bottom 0.152: v42.08,27.49 42.08,26.94 41.01,25.87 39.38,25.87 38.76,25.24 U2.3
V_SD-2CH
  Bottom 0.152: IC2.11 42.88,32.62 40.01,32.62 36.88,35.74 36.88,36.12 U6.3
VDD  (via drill 0.3)
  Top 0.152: v27.76,26.24 26.38,27.62 Q3.8 | Q3.5 25.38,31.24 25.41,31.24 | Q3.6 25.38,29.99 Q3.6 | Q3.7 25.38,28.62 25.41,28.62 | v35.26,29.24 33.41,29.24 | Q1.6 33.38,29.99 Q1.6 | Q1.7 33.38,28.62 33.41,28.62 | Q5.6 17.38,29.99 Q5.6 | Q5.7 17.38,28.74 Q5.7 | v29.01,38.74 29.63,38.74 Q9.8 | v24.13,40.99 24.13,39.74 23.51,39.12 Q7.8 | v15.01,33.24 15.01,33.37 | v33.76,34.12 33.76,32.87 | 30.51,33.37 30.51,32.99 | Q11.8 38.63,38.74 38.61,38.21 | Q11.7 38.63,37.49 Q11.7 | 38.61,36.12 38.63,36.12 Q11.6 39.51,36.37 v40.26,36.37 | Q9.7 30.63,37.49 Q9.7 | Q7.7 22.63,37.49 Q7.7 | Q9.6 30.63,36.12 Q9.5 | Q7.6 22.63,36.12 Q7.5 | v26.51,32.12 26.51,32.99 | 17.41,30.87 18.26,30.87 19.01,31.87 | v47.13,49.24 48.13,48.24 v48.13,45.87 | Q1.5 33.38,31.62 33.38,32.87 | 25.41,31.74 25.38,31.74 25.38,32.99
  Top 2: 38.61,38.21 Q11.7 Q11.6 38.61,36.12 Q11.5 37.87,34.22 | Q1.5 Q1.6 33.41,29.24 Q1.7 33.41,28.62 Q1.8 | Q9.8 Q9.7 Q9.6 Q9.5 | 25.41,32.43 25.41,31.74 Q3.5 25.41,31.24 Q3.6 Q3.7 25.41,28.62 Q3.8 | Q7.8 Q7.7 Q7.6 Q7.5 | 19.08,31.43 17.57,31.43 Q5.5 17.41,30.87 Q5.6 Q5.7 Q5.8
  Top 2.54: 37.87,34.22 36.51,32.87 33.76,32.87 33.38,32.87 32.42,32.87 32.29,32.99 30.51,32.99 26.51,32.99 25.38,32.99 22.51,32.99 | 22.51,32.99 20.13,32.99 | 20.13,32.99 19.01,31.87 | Q7.5 22.61,33.09 22.51,32.99 | Q9.5 30.61,33.47 30.51,33.37 | 20.13,32.99 17.01,32.99 | 17.01,32.99 16.76,33.24 15.72,33.24 | 15.72,33.24 15.59,33.37 15.01,33.37 7.53,33.37 X1.2 | 17.01,32.99 15.96,32.99 15.72,33.24
  Bottom 0.152: U1.1 39.13,12.74 38.63,12.74 37.13,11.24 37.13,10.87 34.63,8.37 32.76,8.37 31.26,9.87 29.51,9.87 D6.A 29.38,9.99 29.13,9.99 28.01,11.12 28.01,13.87 33.26,19.12 36.76,19.12 37.51,19.87 37.51,21.12 34.01,24.62 31.01,24.62 D1.A 31.01,24.74 29.26,24.74 v27.76,26.24 | v35.26,29.24 36.63,27.87 38.63,27.87 U2.1 | 45.63,49.24 45.63,49.87 D5.A 45.63,49.24 | 45.63,49.24 44.51,48.12 D4.A | 26.73,38.49 28.76,38.49 v29.01,38.74 | D3.A 24.51,41.37 v24.13,40.99 | v15.01,33.24 D2.A | v33.76,34.12 33.76,36.99 C9.2 | v40.26,36.37 39.95,36.68 | v26.51,32.12 26.11,31.72 | v47.13,49.24 45.63,49.24 | v48.13,45.87 48.13,44.99 45.01,41.87 45.01,39.87 42.76,37.62 C12.2
  Bottom 0.2: C6.2 39.85,12.77 U1.1 | C2.2 39.35,27.77 U2.1 | C4.2 26.11,31.72 26.73,31.09 U3.1 | C14.2 26.73,38.89 26.73,38.49 U5.1 | U7.1 32.78,37.02 C9.2 | C12.2 40.81,37.54 39.95,36.68 U6.1
W_BLDC-1CH  (via drill 0.3)
  Top 0.152: v20.26,28.87 21.63,28.87 Q5.2 | 22.61,23.77 21.76,23.49 Q6.6 | v15.76,29.87 15.76,27.37 17.01,26.12 22.61,26.12 | Q6.7 20.38,23.49 20.38,23.47
  Top 0.406: Q5.3 22.61,29.82 | Q5.2 Q5.1 | Q6.5 Q6.6 21.51,23.47
  Top 2: 21.51,23.47 20.38,23.47 Q6.7 Q6.8 | 22.61,29.82 Q5.2 22.61,26.12 22.61,23.77 Q6.5 22.91,22.96 24.51,21.37 24.51,16.53 22.84,14.87 20.71,14.87 X2.3
  Bottom 0.152: R10.1 17.13,31.87 17.13,30.37 17.01,30.24 C5.2 17.01,30.12 16.01,30.12 v15.76,29.87 | v20.26,28.87 20.88,28.24 21.26,28.24 U3.6
W_BLDC-2CH  (via drill 0.3)
  Top 0.152: 33.1,40.87 v31.01,40.87 | v40.88,49.87 41.19,50.18 | Q12.7 35.63,42.74 35.63,42.77 | Q12.6 34.38,42.74 34.38,42.77 | Q11.1 33.38,38.74 33.1,38.74 | Q11.2 33.38,37.49 33.1,36.72 | Q11.3 33.38,36.12 33.41,36.41
  Top 2: 33.41,36.41 33.1,36.72 33.1,38.74 33.1,40.87 Q12.5 Q12.6 34.38,42.77 35.63,42.77 Q12.7 Q12.8 39.31,40.37 42.51,40.37 44.01,41.87 44.01,47.37 41.19,50.18 40.51,50.87 39.61,50.87 31.83,58.65 X3.3
  Bottom 0.152: 39.88,49.87 39.88,48.37 R24.1 | v31.01,40.87 29.88,41.99 U7.6 | v40.88,49.87 39.88,49.87 | 39.88,49.87 C13.2
W_IN-1CH  (via drill 0.3)
  Top 0.152: v42.26,28.49 43.01,29.24 IC1.10 | v36.51,29.24 36.51,28.99 35.38,27.87 v35.38,26.74
  Bottom 0.152: v42.26,28.49 41.51,29.24 v36.51,29.24 | v35.38,26.74 34.38,26.74 34.01,27.12 29.26,27.12 26.76,29.62 U3.2
W_IN-2CH
  Bottom 0.152: IC2.10 42.88,31.74 35.26,31.74 31.26,35.74 31.26,36.62 U7.2
W_SD-1CH  (via drill 0.3)
  Top 0.152: v43.28,25.99 43.28,26.89 44.13,27.74 44.13,27.99 IC1.12
  Bottom 0.152: U3.3 26.76,28.12 27.01,28.12 29.38,25.74 34.76,25.74 37.13,23.37 40.66,23.37 42.6,25.31 42.6,25.34 42.91,25.65 42.94,25.65 v43.28,25.99
W_SD-2CH
  Bottom 0.152: IC2.12 43.01,33.24 43.51,33.24 43.88,32.87 43.88,30.49 43.76,30.37 36.01,30.37 29.76,36.62 U7.3